# Altium schematic sheet 3_3V_DIST.SchDoc: 3.3V Distribution
size Letter; Organization: University of California; Address1: 475 Portola Plaza; Address2: Los Angeles, CA 90095; Revision: R01; SheetNumber: 1; SheetTotal: 1
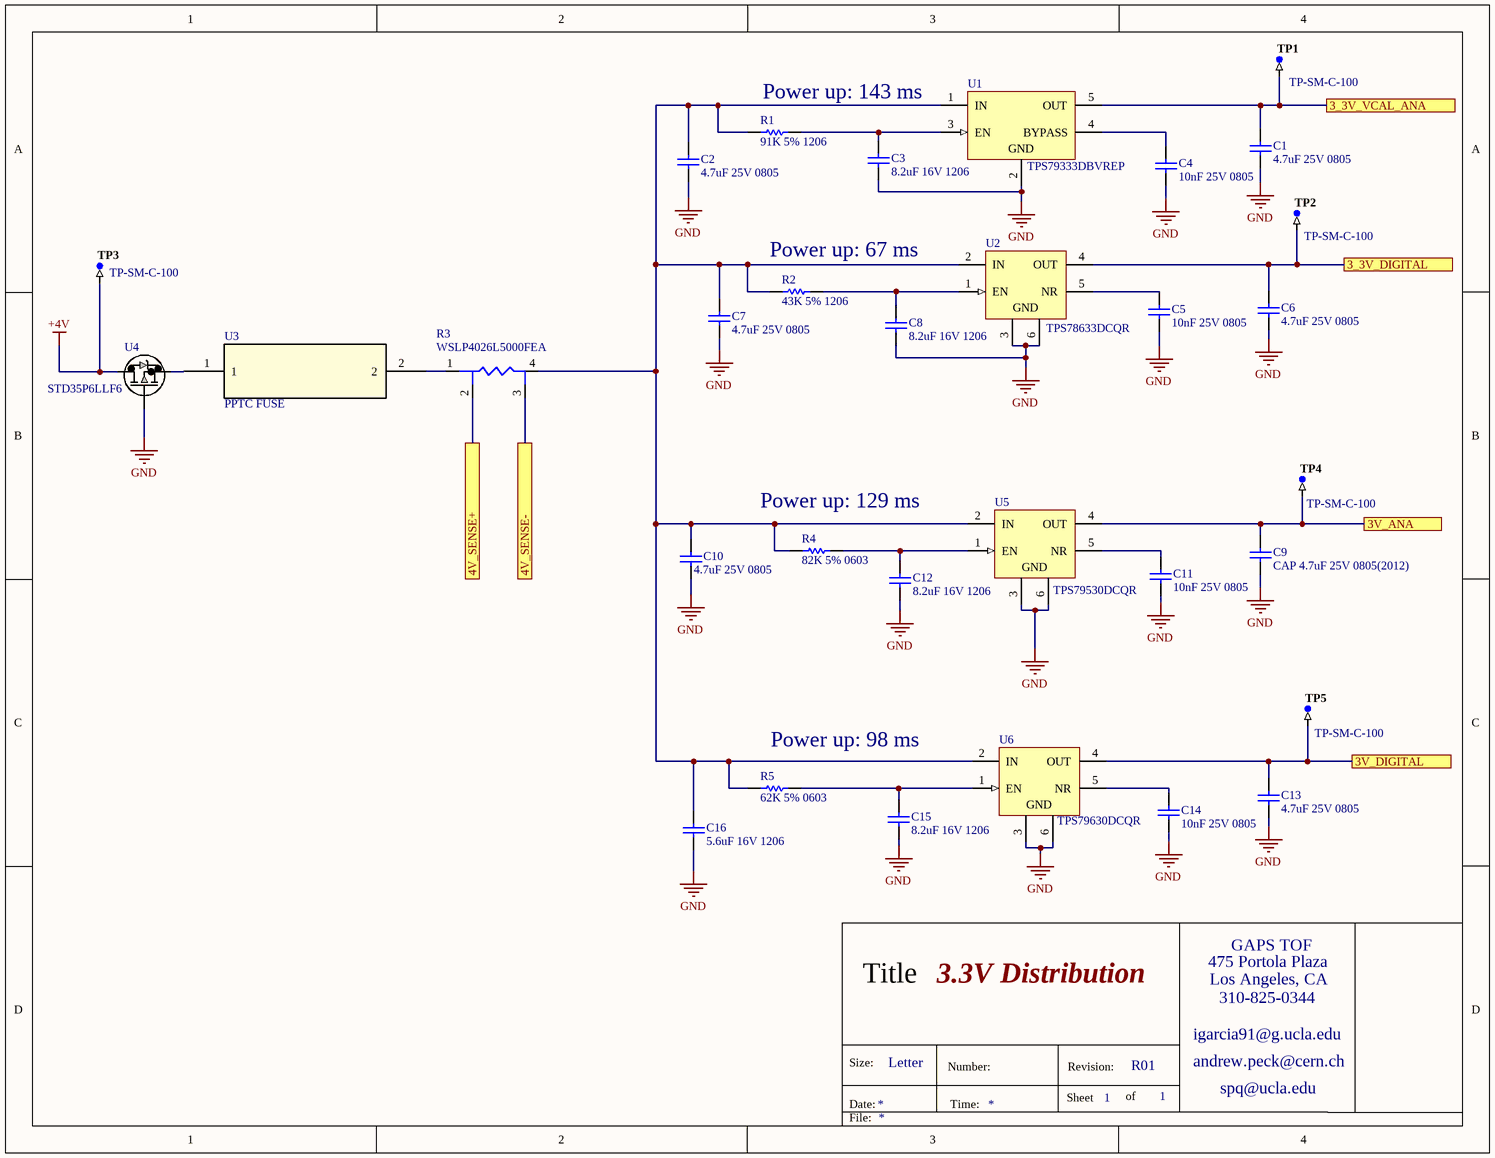
[diagram p0: 3_3V_DIST.SchDoc]

## Parts
C1  4.7uF 25V 0805  [CAPC0805(2012)145_L]
C2  4.7uF 25V 0805  [CAPC0805(2012)145_L]
C3  8.2uF 16V 1206  [CAPC1206(3216)190_N]
C4  10nF 25V 0805  [CAPC0805(2012)145_M]
C5  10nF 25V 0805  [CAPC0805(2012)145_M]
C6  4.7uF 25V 0805  [CAPC0805(2012)145_L]
C7  4.7uF 25V 0805  [CAPC0805(2012)145_L]
C8  8.2uF 16V 1206  [CAPC1206(3216)190_N]
C9  CAP 4.7uF 25V 0805(2012)  [CAPC0805(2012)145_L]
C10  4.7uF 25V 0805  [CAPC0805(2012)145_L]
C11  10nF 25V 0805  [CAPC0805(2012)145_M]
C12  8.2uF 16V 1206  [CAPC1206(3216)190_N]
C13  4.7uF 25V 0805  [CAPC0805(2012)145_L]
C14  10nF 25V 0805  [CAPC0805(2012)145_M]
C15  8.2uF 16V 1206  [CAPC1206(3216)190_N]
C16  5.6uF 16V 1206  [CAPC1206(3216)190_N]
R1  91K 5% 1206  [RESC1206(3216)_M]
R2  43K 5% 1206  [RESC1206(3216)_N]
R3  WSLP4026L5000FEA
R4  82K 5% 0603  [RESC0603(1608)_M]
R5  62K 5% 0603  [RESC0603(1608)_L]
TP1  TP-SM-C-100  [TP-SM-C-100]  (no BOM)
TP2  TP-SM-C-100  [TP-SM-C-100]  (no BOM)
TP3  TP-SM-C-100  [TP-SM-C-100]  (no BOM)
TP4  TP-SM-C-100  [TP-SM-C-100]  (no BOM)
TP5  TP-SM-C-100  [TP-SM-C-100]  (no BOM)
U1  TPS79333DBVREP  [DBV0005A_M]
U2  TPS78633DCQR  [DCQ0006A_L]
U3  PPTC FUSE  [0ZCF]
U4  STD35P6LLF6  [DPAK]
U5  TPS79530DCQR  [DCQ0006A_L]
U6  TPS79630DCQR  [DCQ0006A_L]

## Ports
3_3V_DIGITAL, 3_3V_VCAL_ANA, 3V_ANA, 3V_DIGITAL, 4V_SENSE+, 4V_SENSE-

## Nets
+4V: TP3.1 U4.2(D)
GND: C1.1 C2.1 C3.1 C4.1 C5.1 C6.1 C7.1 C8.1 C9.1 C10.1 C11.1 C12.1 C13.1 C14.1 C15.1 C16.1 U1.2(GND) U2.3(GND) U2.6(GND) U4.1(G) U5.3(GND) U5.6(GND) U6.3(GND) U6.6(GND)
3_3V_DIGITAL: C6.2 TP2.1 U2.4(OUT) ; port 3_3V_DIGITAL
3_3V_VCAL_ANA: C1.2 TP1.1 U1.5(OUT) ; port 3_3V_VCAL_ANA
3V_ANA: C9.2 TP4.1 U5.4(OUT) ; port 3V_ANA
3V_DIGITAL: C13.2 TP5.1 U6.4(OUT) ; port 3V_DIGITAL
4V_SENSE+: R3.2 ; port 4V_SENSE+
4V_SENSE-: R3.3 ; port 4V_SENSE-
NetC2_2: C2.2 C7.2 C10.2 C16.2 R1.1 R2.1 R3.4 R4.1 R5.1 U1.1(IN) U2.2(IN) U5.2(IN) U6.2(IN)
NetC3_2: C3.2 R1.2 U1.3(EN)
NetC4_2: C4.2 U1.4(BYPASS)
NetC5_2: C5.2 U2.5(NR)
NetC8_2: C8.2 R2.2 U2.1(EN)
NetC11_2: C11.2 U5.5(NR)
NetC12_2: C12.2 R4.2 U5.1(EN)
NetC14_2: C14.2 U6.5(NR)
NetC15_2: C15.2 R5.2 U6.1(EN)
NetR3_1: R3.1 U3.2
NetU3_1: U3.1 U4.3(S)

## Notes on the sheet
- Power up: 143 ms
- (near R2) Power up: 67 ms
- (near R4) Power up: 129 ms
- (near R5) Power up: 98 ms
- 475 Portola Plaza
- GAPS TOF
- Title
- igarcia91@g.ucla.edu
- Los Angeles, CA
- 310-825-0344
- Size:
- Date:
- Letter
- Number:
- Time:
- Sheet
- Revision:
- of
- andrew.peck@cern.ch
- spq@ucla.edu
- File:

## Library data of the parts
C1 C2 C6 C7 C9 C10 C13 = CMP-1036-04895-1: CAP 4.7uF 25V ±10% 0805 (2012 Metric) Thickness 1.45mm SMD; Case-Metric: 2012; Case-EIA: 0805; Tolerance: Â±10%; Value: 4.7uF; Technology: SMT; Rated Voltage: 25 V; Max Thickness: 1.45 mm
C3 C8 C12 C15 = CMP-1037-04959-1: CAP 8.2uF 16V ±20% 1206 (3216 Metric) Thickness 1.9mm SMD; Case-EIA: 1206; Case-Metric: 3216; Tolerance: Â±20%; Technology: SMT; Max Thickness: 1.9 mm; Value: 8.2uF; Rated Voltage: 16 V
C4 C5 C11 C14 = CMP-1036-03831-1: CAP 10nF 25V ±10% 0805 (2012 Metric) Thickness 1.45mm SMD; Case-EIA: 0805; Case-Metric: 2012; Tolerance: Â±10%; Value: 10nF; Max Thickness: 1.45 mm; Technology: SMT; Rated Voltage: 25 V
C16 = CMP-1037-04932-1: CAP 5.6uF 16V ±10% 1206 (3216 Metric) Thickness 1.9mm SMD; Tolerance: Â±10%; Case-Metric: 3216; Case-EIA: 1206; Technology: SMT; Rated Voltage: 16 V; Value: 5.6uF; Max Thickness: 1.9 mm
R1 = CMP-1014-00121-1: 91K 0.25W 5% 1206 (3216 Metric)  SMD; Value: 91000.00 Ohm; Case-Metric: 3216; Case-EIA: 1206; Tolerance: 5 %; Power: 0.25 W; Technology: SMT
R2 = CMP-1014-00113-1: 43K 0.25W 5% 1206 (3216 Metric)  SMD; Case-EIA: 1206; Case-Metric: 3216; Value: 43000.00 Ohm; Tolerance: 5 %; Technology: SMT; Power: 0.25 W
R3 = WSLP4026L5000FEA: Current Sense Resistors - SMD 7watt .0005ohm 1%
R4 = CMP-1012-00120-1: 82K 0.1W 5% 0603 (1608 Metric)  SMD; Case-Metric: 1608; Case-EIA: 0603; Value: 82000.00 Ohm; Technology: SMT; Tolerance: 5 %; Power: 0.1 W
R5 = CMP-1012-00117-1: 62K 0.1W 5% 0603 (1608 Metric)  SMD; Value: 62000.00 Ohm; Case-Metric: 1608; Case-EIA: 0603; Technology: SMT; Power: 0.1 W; Tolerance: 5 %
TP1-TP5 = CMP-0484-00002-2: Test Point, Surface Mount, Circular, Pad Diameter 1 mm; Manufacturer: No Vendor; PartNumber: TP-SM-C-100
U1 = CMP-0394-00316-2: Single Output Fast RF LDO, 200 mA, Fixed 3.3 V Output, 2.7 to 5.5 V Input, 5-pin SOT-23 (DBV), -40 to 125 degC, Green (RoHS & no Sb/Br); Manufacturer: Texas Instruments; Accuracy(%): 2; SubFamily: Single Channel LDO; Vin(Max)(V): 5.5; Fixed Output Options(V): 3.3; Vdo(Typ)(mV): 102; Iout(Max)(A): 0.2; Rating: HiRel Enhanced Product; Vin(Min)(V): 2.7; DatasheetVersion: SGLS163B; PackageVersion: 4073253-4/K; Code_JEDEC: MO-178; PackageDescription: 5-Pin Plastic Small Outline, Body 1.60 Ãƒâ€” 2.90 mm, Pitch 0.95 mm; ComponentLink1Description: Manufacturer URL; ComponentLink1URL: http://www.ti.com/; ComponentLink2Description: Datasheet; ComponentLink2URL: http://www.ti.com/general/docs/lit/getliterature.tsp?genericPartNumber=TPS79333-EP&fileType=pdf; ComponentLink3URL: http://www.ti.com/litv/pdf/mpds018i; Mounting Technology: Surface Mount; PartNumber: TPS79333DBVREP; Vout Adj(Min)(V): 3.3; PackageReference: DBV0005A; Iq(Typ)(mA): 0.2; Vout Adj(Max)(V): 3.3; Eco-Plan: Green (RoHS & no Sb/Br); ComponentLink3Description: Package Specification
U2 = CMP-0395-00353-2: Single Output High PSRR LDO, 1.5 A, Fixed 3.3 V Output, 2.7 to 5.5 V Input, 6-pin SOT-223 (DCQ), -40 to 125 degC, Green (RoHS & no Sb/Br); Manufacturer: Texas Instruments; Vdo(Typ)(mV): 340; Iq(Typ)(mA): 0.02; Fixed Output Options(V): 3.3; Iout(Max)(A): 1.5; Accuracy(%): 3; SubFamily: Single Channel LDO; Vin(Max)(V): 5.5; Vin(Min)(V): 2.7; ComponentLink2URL: http://www.ti.com/general/docs/lit/getliterature.tsp?genericPartNumber=TPS78633&fileType=pdf; PackageDescription: 6-Pin Plastic Small Outline, Body 3.5 x 6.5 mm, Pitch 1.27 mm; Eco-Plan: Green (RoHS & no Sb/Br); ComponentLink2Description: Datasheet; ComponentLink1URL: http://www.ti.com/; Mounting Technology: Surface Mount; Vout Adj(Min)(V): 3.3; ComponentLink1Description: Manufacturer URL; PackageReference: DCQ0006A; ComponentLink3URL: http://www.ti.com/litv/pdf/mpds098c; PackageVersion: 4202109/D; ComponentLink3Description: Package Specification; PartNumber: TPS78633DCQR; Vout Adj(Max)(V): 3.3; DatasheetVersion: SLVS389L
U3 = 0ZCF0250FF2C: Resettable Fuses - PPTC; Vendor: Belfuse; Built_By: EMA_UL_Team; C: Copyright (C) 2016 Accelerated Designs. All rights reserved; Manufacturer_Part_Number: 0ZCF0250FF2C; RefDes: RefDes; Type: DEV; Value: Value
U4 = STD35P6LLF6: MOSFET P-channel 60 V, 0.025 Ohm typ., 35 A STripFET F6 Power MOSFET in a DPAK package; Manufacturer_Part_Number: STD35NF06T4; Vendor: STMicroelectronics; Built_By: EMA_UL_Team; C: Copyright (C) 2015 Accelerated Designs. All rights reserved; RefDes: RefDes; Type: DEV; Value: Value
U5 = CMP-0395-00302-2: Single Output High PSRR LDO, 500 mA, Fixed 3 V Output, 2.7 to 5.5 V Input, 6-pin SOT-223 (DCQ), -40 to 125 degC, Green (RoHS & no Sb/Br); Manufacturer: Texas Instruments; Accuracy(%): 2; Fixed Output Options(V): 3; Iq(Typ)(mA): 0.26; Vdo(Typ)(mV): 110; Vin(Min)(V): 2.7; Vin(Max)(V): 5.5; Iout(Max)(A): 0.5; Rating: Catalog; SubFamily: Single Channel LDO; ComponentLink2URL: http://www.ti.com/general/docs/lit/getliterature.tsp?genericPartNumber=TPS79530&fileType=pdf; PackageDescription: 6-Pin Plastic Small Outline, Body 3.5 x 6.5 mm, Pitch 1.27 mm; Mounting Technology: Surface Mount; ComponentLink1URL: http://www.ti.com/; ComponentLink3URL: http://www.ti.com/litv/pdf/mpds098c; DatasheetVersion: SLVS350H; Vout Adj(Max)(V): 3; PackageVersion: 4202109/D; ComponentLink2Description: Datasheet; Vout Adj(Min)(V): 3; Eco-Plan: Green (RoHS & no Sb/Br); PartNumber: TPS79530DCQR; ComponentLink3Description: Package Specification; ComponentLink1Description: Manufacturer URL; PackageReference: DCQ0006A
U6 = CMP-0395-00336-2: Single Output High PSRR LDO, 1 A, Fixed 3 V Output, 2.7 to 5.5 V Input, 6-pin SOT-223 (DCQ), -40 to 125 degC, Green (RoHS & no Sb/Br); Manufacturer: Texas Instruments; Fixed Output Options(V): 3; Vdo(Typ)(mV): 250; Iout(Max)(A): 1; Vin(Min)(V): 2.7; SubFamily: Single Channel LDO; Accuracy(%): 2; Vin(Max)(V): 5.5; Iq(Typ)(mA): 0.26; ComponentLink1URL: http://www.ti.com/; ComponentLink1Description: Manufacturer URL; ComponentLink3URL: http://www.ti.com/litv/pdf/mpds098c; Mounting Technology: Surface Mount; Vout Adj(Max)(V): 3; Vout Adj(Min)(V): 3; ComponentLink2Description: Datasheet; ComponentLink3Description: Package Specification; DatasheetVersion: SLVS351N; PackageVersion: 4202109/D; ComponentLink2URL: http://www.ti.com/general/docs/lit/getliterature.tsp?genericPartNumber=TPS79630&fileType=pdf; Eco-Plan: Green (RoHS & no Sb/Br); PackageReference: DCQ0006A; PackageDescription: 6-Pin Plastic Small Outline, Body 3.5 x 6.5 mm, Pitch 1.27 mm; PartNumber: TPS79630DCQR